# EAGLE schematic master (EAGLE 7.1.0)
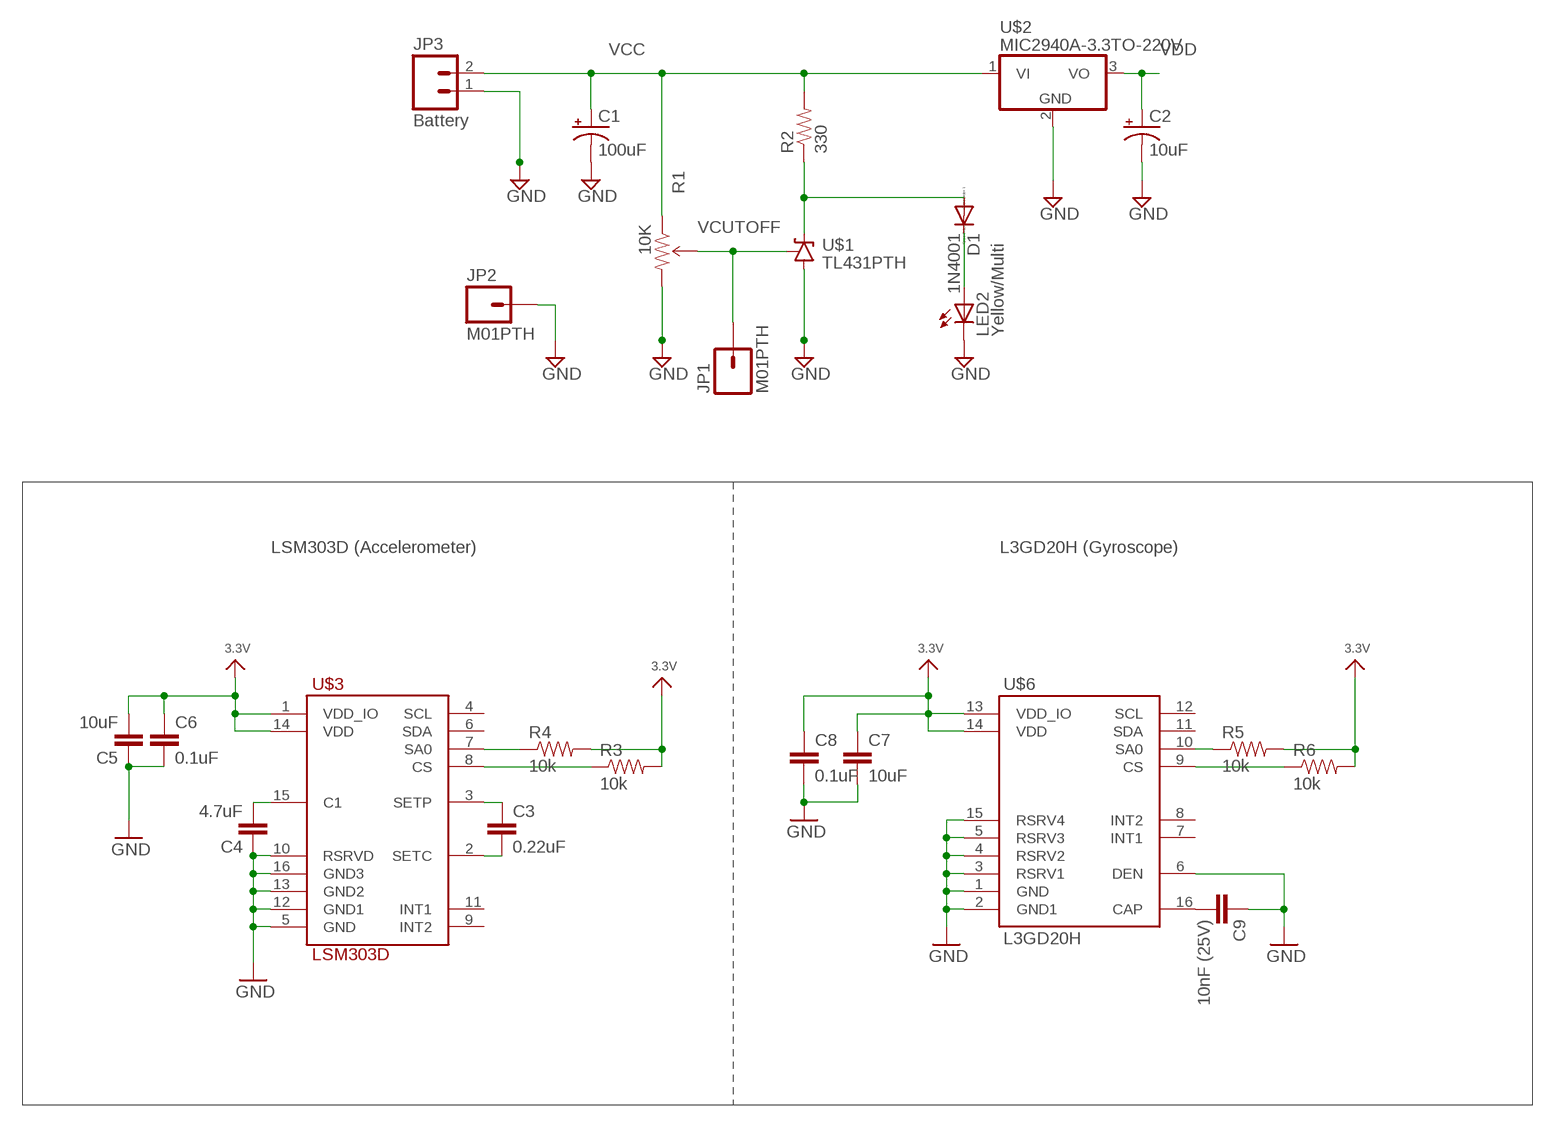
[diagram p0: schematic, sheet 1, part 1 of 2]
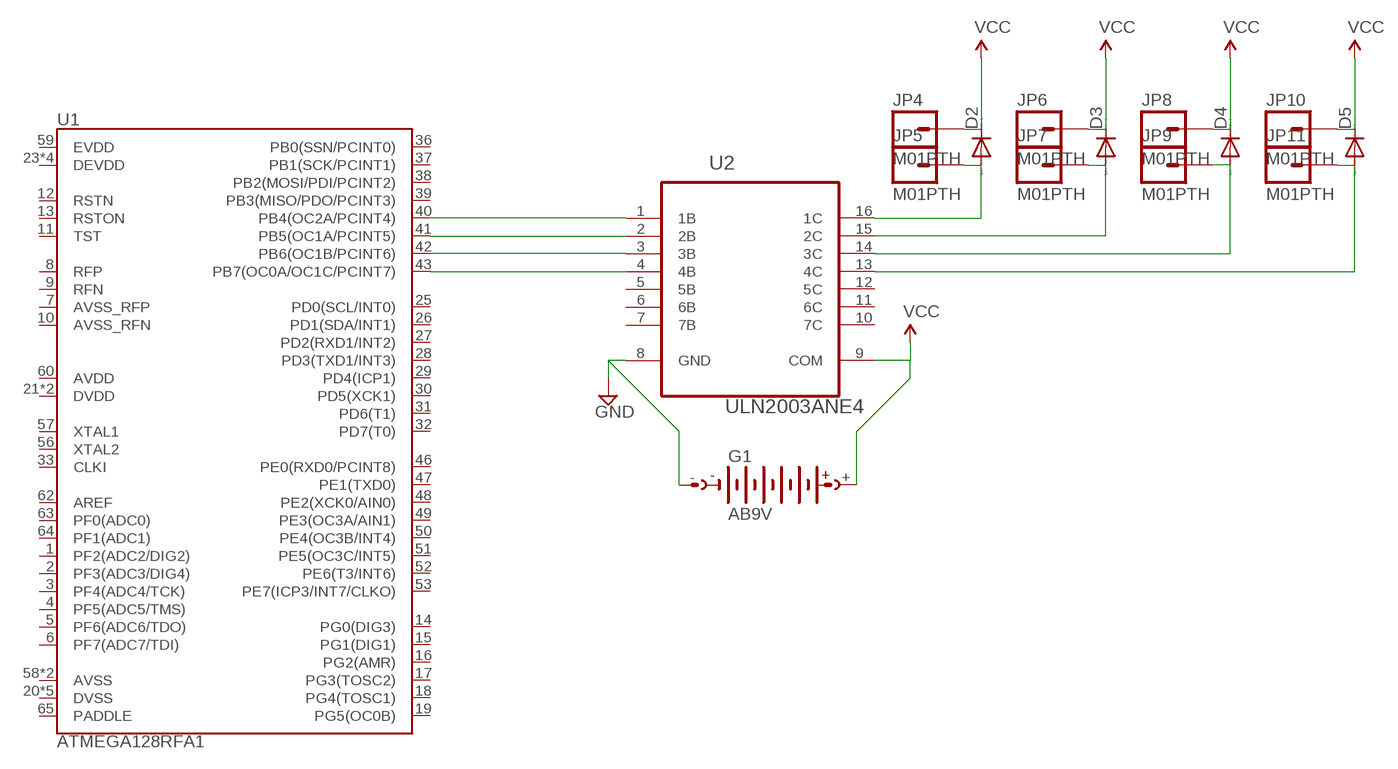
[diagram p1: schematic, sheet 1, part 2 of 2]

## Parts
C1  100uF  CPOL-USE3.5-8  [E3,5-8]
C2  10uF  CPOL-USE2.5-5  [E2,5-5]
C3  0.22uF  CAP0805  [0805]
C4  4.7uF  CAP0805  [0805]
C5  10uF  CAP0805  [0805]
C6  0.1uF  CAP0805  [0805]
C7  10uF  CAP0805  [0805]
C8  0.1uF  CAP0805  [0805]
C9  10nF (25V)  CAP0805  [0805]
D1  1N4001  1N4004  [DO41-10]
D2  DIODE-D-5  [D-5]
D3  DIODE-D-5  [D-5]
D4  DIODE-D-5  [D-5]
D5  DIODE-D-5  [D-5]
G1  AB9V  [AB9V]
JP1  M01PTH  [1X01]
JP2  M01PTH  [1X01]
JP3  Battery  M02PTH  [1X02]
JP4  M01PTH  [1X01]
JP5  M01PTH  [1X01]
JP6  M01PTH  [1X01]
JP7  M01PTH  [1X01]
JP8  M01PTH  [1X01]
JP9  M01PTH  [1X01]
JP10  M01PTH  [1X01]
JP11  M01PTH  [1X01]
LED2  Yellow/Multi  LED5MM  [LED5MM]
R1  10K  TRIMPOT-PTH-KNOB  [3386U]
R2  330  RESISTORAXIAL-0.3  [AXIAL-0.3]
R3  10k  RESISTOR0805-RES  [0805]
R4  10k  RESISTOR0805-RES  [0805]
R5  10k  RESISTOR0805-RES  [0805]
R6  10k  RESISTOR0805-RES  [0805]
U1  ATMEGA128RFA1  [QFN-64]
U2  ULN2003ANE4  [DIP254P762X508-16]
U$1  TL431PTH  [TO-92]
U$2  MIC2940A-3.3TO-220V  [TO-220V]
U$3  LSM303D  [LGA16_3X3MM]
U$6  L3GD20H  [LGA16_3X3MM]

## Nets
3.3V: C5.2 C6.1 C7.1 C8.1 R3.2 R4.2 R5.2 R6.2 U$3.1(VDD_IO) U$3.14(VDD) U$6.13(VDD_IO) U$6.14(VDD)
GND: C1.- C2.- C4.1 C5.1 C6.2 C7.2 C8.2 C9.1 G1.- JP2.1 JP3.1 LED2.K(C) R1.3(CW) U2.8(GND) U$1.2(A) U$2.2(GND) U$3.5(GND) U$3.10(RSRVD) U$3.12(GND1) U$3.13(GND2) U$3.16(GND3) U$6.1(GND) U$6.2(GND1) U$6.3(RSRV1) U$6.4(RSRV2) U$6.5(RSRV3) U$6.6(DEN) U$6.15(RSRV4)
N$1: D1.C LED2.A
N$2: D1.A R2.P$1 U$1.3(C)
N$3: C3.1 U$3.3(SETP)
N$4: C3.2 U$3.2(SETC)
N$5: R3.1 U$3.8(CS)
N$6: R4.1 U$3.7(SA0)
N$7: C4.2 U$3.15(C1)
N$8: R5.1 U$6.10(SA0)
N$9: R6.1 U$6.9(CS)
N$10: C9.2 U$6.16(CAP)
N$11: U1.40(PB4(OC2A/PCINT4)) U2.1(1B)
N$12: U1.41(PB5(OC1A/PCINT5)) U2.2(2B)
N$13: U1.42(PB6(OC1B/PCINT6)) U2.3(3B)
N$14: U1.43(PB7(OC0A/OC1C/PCINT7)) U2.4(4B)
N$15: D2.A JP5.1 U2.16(1C)
N$16: D3.A JP7.1 U2.15(2C)
N$17: D4.A JP9.1 U2.14(3C)
N$18: D5.A JP11.1 U2.13(4C)
VCC: C1.+ D2.C D3.C D4.C D5.C G1.+ JP3.2 JP4.1 JP6.1 JP8.1 JP10.1 R1.1(CCW) R2.P$2 U2.9(COM) U$2.1(VI)
VCUTOFF: JP1.1 R1.2(WIPER) U$1.1(R)
VDD: C2.+ U$2.3(VO)
Unconnected: U1.1(PF2(ADC2/DIG2)) U1.2(PF3(ADC3/DIG4)) U1.3(PF4(ADC4/TCK)) U1.4(PF5(ADC5/TMS)) U1.5(PF6(ADC6/TDO)) U1.6(PF7(ADC7/TDI)) U1.7(AVSS_RFP) U1.8(RFP) U1.9(RFN) U1.10(AVSS_RFN) U1.11(TST) U1.12(RSTN) U1.13(RSTON) U1.14(PG0(DIG3)) U1.15(PG1(DIG1)) U1.16(PG2(AMR)) U1.17(PG3(TOSC2)) U1.18(PG4(TOSC1)) U1.19(PG5(OC0B)) U1.20(DVSS) U1.21(DVDD) U1.22(DVDD) U1.23(DEVDD) U1.24(DVSS) U1.25(PD0(SCL/INT0)) U1.26(PD1(SDA/INT1)) U1.27(PD2(RXD1/INT2)) U1.28(PD3(TXD1/INT3)) U1.29(PD4(ICP1)) U1.30(PD5(XCK1)) U1.31(PD6(T1)) U1.32(PD7(T0)) U1.33(CLKI) U1.34(DEVDD) U1.35(DVSS) U1.36(PB0(SSN/PCINT0)) U1.37(PB1(SCK/PCINT1)) U1.38(PB2(MOSI/PDI/PCINT2)) U1.39(PB3(MISO/PDO/PCINT3)) U1.44(DEVDD) U1.45(DVSS) U1.46(PE0(RXD0/PCINT8)) U1.47(PE1(TXD0)) U1.48(PE2(XCK0/AIN0)) U1.49(PE3(OC3A/AIN1)) U1.50(PE4(OC3B/INT4)) U1.51(PE5(OC3C/INT5)) U1.52(PE6(T3/INT6)) U1.53(PE7(ICP3/INT7/CLKO)) U1.54(DEVDD) U1.55(DVSS) U1.56(XTAL2) U1.57(XTAL1) U1.58(AVSS) U1.59(EVDD) U1.60(AVDD) U1.61(AVSS) U1.62(AREF) U1.63(PF0(ADC0)) U1.64(PF1(ADC1)) U1.65(PADDLE) U2.5(5B) U2.6(6B) U2.7(7B) U2.10(7C) U2.11(6C) U2.12(5C) U$3.4(SCL) U$3.6(SDA) U$3.9(INT2) U$3.11(INT1) U$6.7(INT1) U$6.8(INT2) U$6.11(SDA) U$6.12(SCL)

## Notes on the sheet
- LSM303D (Accelerometer) | L3GD20H (Gyroscope)

## Library data of the parts
C1 C2 = rcl:CPOL-US: POLARIZED CAPACITOR, American symbol
C3-C9 = SparkFun-Capacitors:CAP: Capacitor Standard 0603 ceramic capacitor, and 0.1" leaded capacitor.
D1 = diode:1N4004: DIODE general purpose rectifier, 1 A
D2-D5 = diode:DIODE-: DIODE
G1 = battery:AB9V: 9-V BATTERY CLIP
JP1 JP2 JP4-JP11 = SparkFun:M01: Header 1 Standard 1-pin 0.1" header. Use with straight break away headers (SKU : PRT-00116), right angle break away headers (PRT-00553), swiss pins (PRT-00743), machine pins (PRT-00117), and female headers (PRT-00115).
JP3 = SparkFun:M02: Header 2 Standard 2-pin 0.1" header. Use with straight break away headers (SKU : PRT-00116), right angle break away headers (PRT-00553), swiss pins (PRT-00743), machine pins (PRT-00117), and female headers (PRT-00115). Molex polarized connector foot print use with SKU : PRT-08233 with associated crimp pins and housings.
LED2 = SparkFun:LED: LEDs Standard schematic elements and footprints for 5mm, 3mm, 1206, and 0603 sized LEDs. 5mm - Spark Fun Electronics SKU : COM-00529 (and others)
R1 = Power:TRIMPOT; CREATOR: Brandon; REVIEWER1: Chris
R2 = SparkFun:RESISTOR: Resistor Basic schematic elements and footprints for 0603, 1206, and PTH resistors.
R3-R6 = SparkFun-Passives:RESISTOR: Resistor Basic schematic elements and footprints for 0603, 1206, and PTH resistors.
U1 = ATmega128RFA1-DevBoard:ATMEGA128RFA1: ATmega128RFA1 8-bit AVR Microcontroller with Low Power 2.4GHz Transceiver for ZigBee and IEEE 802.15.4
U2 = Texas Instruments_By_element14_Batch_1:ULN2003ANE4: HIGH-VOLTAGE, HIGH-CURRENT DARLINGTON TRANSISTOR ARRAYS; MPN: ULN2003ANE4; OC_FARNELL: 1210973; OC_NEWARK: 98K2130; PACKAGE: PDIP-16; SUPPLIER: Texas Instruments
U$1 = SparkFun:TL431
U$2 = SparkFun:MIC2940A-3.3: MIC2940A-3.3 Voltage Regulator 3.3V mic2940.pdf
U$3 = IMU_parts:LSM303D
U$6 = IMU_parts:L3GD20H